# Altium schematic sheet fmc_connections.SchDoc
size 350 x 229 mm; SheetNumber: 8; SheetTotal: 13
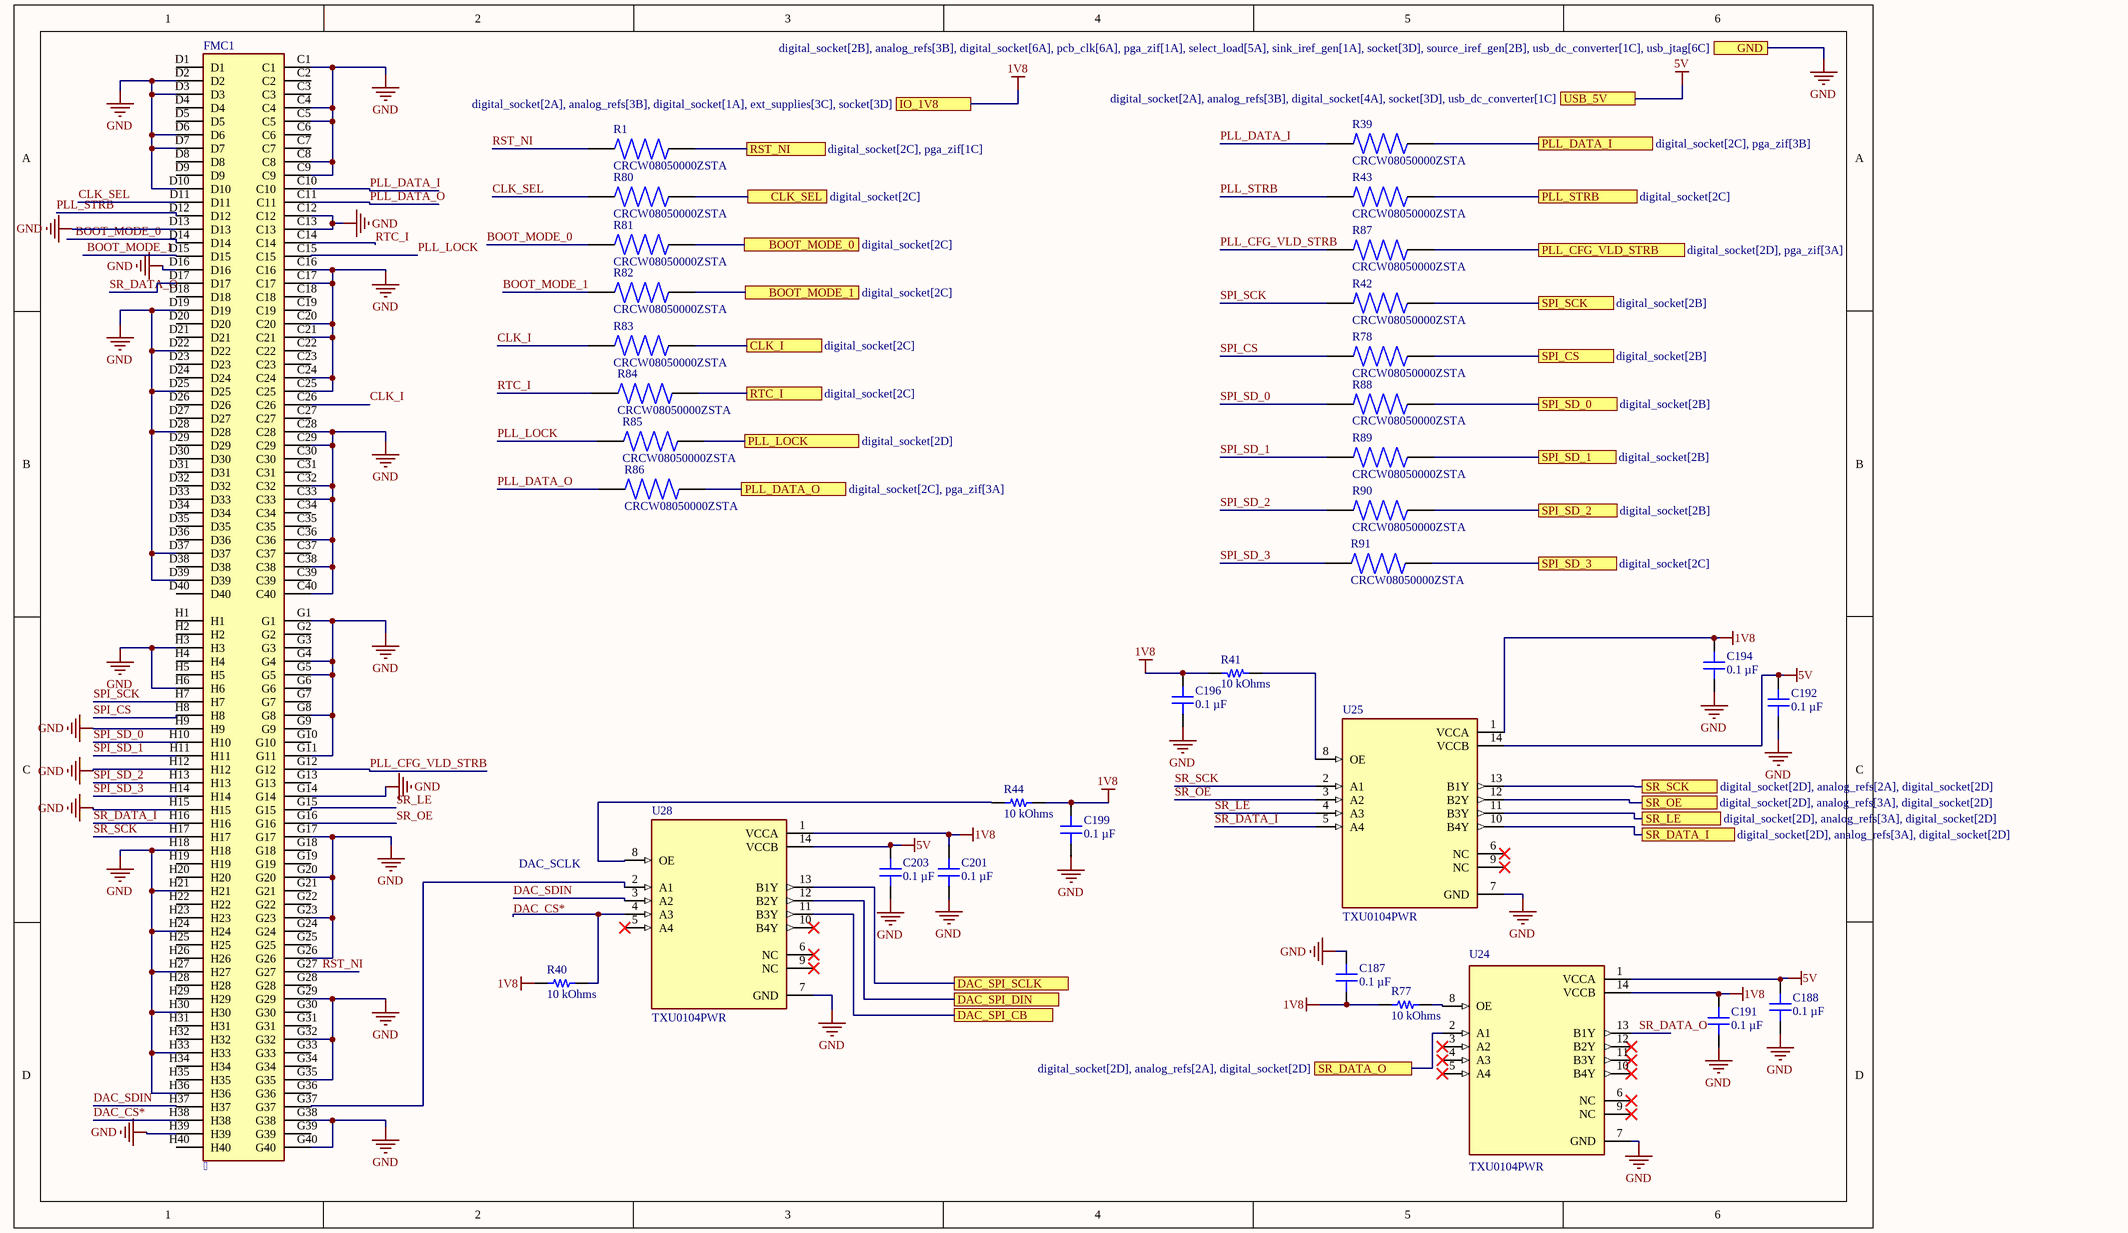
[diagram p0: fmc_connections.SchDoc]

## Parts
C187  0.1 µF  [CAP 0805_2012]
C188  0.1 µF  [CAP 0805_2012]
C191  0.1 µF  [CAP 0805_2012]
C192  0.1 µF  [CAP 0805_2012]
C194  0.1 µF  [CAP 0805_2012]
C196  0.1 µF  [CAP 0805_2012]
C199  0.1 µF  [CAP 0805_2012]
C201  0.1 µF  [CAP 0805_2012]
C203  0.1 µF  [CAP 0805_2012]
FMC1    [SAMTEC_ASP-134604-01]
R1  CRCW08050000ZSTA  [RESC2012X50N]
R39  CRCW08050000ZSTA  [RESC2012X50N]
R40  10 kOhms  [RES 0805_2012]
R41  10 kOhms  [RES 0805_2012]
R42  CRCW08050000ZSTA  [RESC2012X50N]
R43  CRCW08050000ZSTA  [RESC2012X50N]
R44  10 kOhms  [RES 0805_2012]
R77  10 kOhms  [RES 0805_2012]
R78  CRCW08050000ZSTA  [RESC2012X50N]
R80  CRCW08050000ZSTA  [RESC2012X50N]
R81  CRCW08050000ZSTA  [RESC2012X50N]
R82  CRCW08050000ZSTA  [RESC2012X50N]
R83  CRCW08050000ZSTA  [RESC2012X50N]
R84  CRCW08050000ZSTA  [RESC2012X50N]
R85  CRCW08050000ZSTA  [RESC2012X50N]
R86  CRCW08050000ZSTA  [RESC2012X50N]
R87  CRCW08050000ZSTA  [RESC2012X50N]
R88  CRCW08050000ZSTA  [RESC2012X50N]
R89  CRCW08050000ZSTA  [RESC2012X50N]
R90  CRCW08050000ZSTA  [RESC2012X50N]
R91  CRCW08050000ZSTA  [RESC2012X50N]
U24  TXU0104PWR  [SOP65P640X120-14N]
U25  TXU0104PWR  [SOP65P640X120-14N]
U28  TXU0104PWR  [SOP65P640X120-14N]

## Ports
BOOT_MODE_0 (see digital_socket[2C]), BOOT_MODE_1 (see digital_socket[2C]), CLK_I (see digital_socket[2C]), CLK_SEL (see digital_socket[2C]), DAC_SPI_CB (see digital_socket[2B], analog_refs[1B], digital_socket[2B]), DAC_SPI_DIN (see digital_socket[2B], analog_refs[1B], digital_socket[2B]), DAC_SPI_SCLK (see digital_socket[2B], analog_refs[1B], digital_socket[2B]), GND (see digital_socket[2B], analog_refs[3B], digital_socket[6A], pcb_clk[6A], pga_zif[1A], select_load[5A], sink_iref_gen[1A], socket[3D], source_iref_gen[2B], usb_dc_converter[1C], usb_jtag[6C]), IO_1V8 (see digital_socket[2A], analog_refs[3B], digital_socket[1A], ext_supplies[3C], socket[3D]), PLL_CFG_VLD_STRB (see digital_socket[2D], pga_zif[3A]), PLL_DATA_I (see digital_socket[2C], pga_zif[3B]), PLL_DATA_O (see digital_socket[2C], pga_zif[3A]), PLL_LOCK (see digital_socket[2D]), PLL_STRB (see digital_socket[2C]), RST_NI (see digital_socket[2C], pga_zif[1C]), RTC_I (see digital_socket[2C]), SPI_CS (see digital_socket[2B]), SPI_SCK (see digital_socket[2B]), SPI_SD_0 (see digital_socket[2B]), SPI_SD_1 (see digital_socket[2B]), SPI_SD_2 (see digital_socket[2B]), SPI_SD_3 (see digital_socket[2C]), SR_DATA_I (see digital_socket[2D], analog_refs[3A], digital_socket[2D]), SR_DATA_O (see digital_socket[2D], analog_refs[2A], digital_socket[2D]), SR_LE (see digital_socket[2D], analog_refs[3A], digital_socket[2D]), SR_OE (see digital_socket[2D], analog_refs[3A], digital_socket[2D]), SR_SCK (see digital_socket[2D], analog_refs[2A], digital_socket[2D]), USB_5V (see digital_socket[2A], analog_refs[3B], digital_socket[4A], socket[3D], usb_dc_converter[1C])

## Nets
1V8: C187.2 C191.2 C194.2 C196.2 C199.2 C201.2 R40.1 R41.2 R44.2 R77.2 U24.14(VCCB) U25.1(VCCA) U28.1(VCCA) ; port IO_1V8
5V: C188.2 C192.2 C203.2 U24.1(VCCA) U25.14(VCCB) U28.14(VCCB) ; port USB_5V
GND: C187.1 C188.1 C191.1 C192.1 C194.1 C196.1 C199.1 C201.1 C203.1 FMC1.C1 FMC1.C4 FMC1.C5 FMC1.C8 FMC1.C9 FMC1.C12 FMC1.C13 FMC1.C16 FMC1.C17 FMC1.C20 FMC1.C21 FMC1.C24 FMC1.C25 FMC1.C28 FMC1.C29 FMC1.C32 FMC1.C33 FMC1.C36 FMC1.C38 FMC1.C40 FMC1.D2 FMC1.D3 FMC1.D6 FMC1.D7 FMC1.D10 FMC1.D13 FMC1.D16 FMC1.D19 FMC1.D22 FMC1.D25 FMC1.D28 FMC1.D37 FMC1.D39 FMC1.G1 FMC1.G4 FMC1.G5 FMC1.G8 FMC1.G11 FMC1.G14 FMC1.G17 FMC1.G20 FMC1.G23 FMC1.G26 FMC1.G29 FMC1.G32 FMC1.G35 FMC1.G38 FMC1.G40 FMC1.H3 FMC1.H6 FMC1.H9 FMC1.H12 FMC1.H15 FMC1.H18 FMC1.H21 FMC1.H24 FMC1.H27 FMC1.H30 FMC1.H33 FMC1.H36 FMC1.H39 U24.7(GND) U25.7(GND) U28.7(GND) ; port GND
BOOT_MODE_0: FMC1.D14 R81.1
BOOT_MODE_0: R81.2 ; port BOOT_MODE_0  [a separate net that carries the same name]
BOOT_MODE_1: FMC1.D15 R82.1
BOOT_MODE_1: R82.2 ; port BOOT_MODE_1  [a separate net that carries the same name]
CLK_I: FMC1.C26 R83.1
CLK_I: R83.2 ; port CLK_I  [a separate net that carries the same name]
CLK_SEL: FMC1.D11 R80.1
CLK_SEL: R80.2 ; port CLK_SEL  [a separate net that carries the same name]
DAC_CS*: FMC1.H38 R40.2 U28.4(A3)
DAC_SDIN: FMC1.H37 U28.3(A2)
DAC_SPI_CB: U28.11(B3Y) ; port DAC_SPI_CB
DAC_SPI_DIN: U28.12(B2Y) ; port DAC_SPI_DIN
DAC_SPI_SCLK: U28.13(B1Y) ; port DAC_SPI_SCLK
PLL_CFG_VLD_STRB: FMC1.G12 R87.1
PLL_CFG_VLD_STRB: R87.2 ; port PLL_CFG_VLD_STRB  [a separate net that carries the same name]
PLL_DATA_I: FMC1.C10 R39.1
PLL_DATA_I: R39.2 ; port PLL_DATA_I  [a separate net that carries the same name]
PLL_DATA_O: FMC1.C11 R86.1
PLL_DATA_O: R86.2 ; port PLL_DATA_O  [a separate net that carries the same name]
PLL_LOCK: FMC1.C15 R85.1
PLL_LOCK: R85.2 ; port PLL_LOCK  [a separate net that carries the same name]
PLL_STRB: FMC1.D12 R43.1
PLL_STRB: R43.2 ; port PLL_STRB  [a separate net that carries the same name]
RST_NI: FMC1.G27 R1.1
RST_NI: R1.2 ; port RST_NI  [a separate net that carries the same name]
RTC_I: FMC1.C14 R84.1
RTC_I: R84.2 ; port RTC_I  [a separate net that carries the same name]
SPI_CS: FMC1.H8 R78.1
SPI_CS: R78.2 ; port SPI_CS  [a separate net that carries the same name]
SPI_SCK: FMC1.H7 R42.1
SPI_SCK: R42.2 ; port SPI_SCK  [a separate net that carries the same name]
SPI_SD_0: FMC1.H10 R88.1
SPI_SD_0: R88.2 ; port SPI_SD_0  [a separate net that carries the same name]
SPI_SD_1: FMC1.H11 R89.1
SPI_SD_1: R89.2 ; port SPI_SD_1  [a separate net that carries the same name]
SPI_SD_2: FMC1.H13 R90.1
SPI_SD_2: R90.2 ; port SPI_SD_2  [a separate net that carries the same name]
SPI_SD_3: FMC1.H14 R91.1
SPI_SD_3: R91.2 ; port SPI_SD_3  [a separate net that carries the same name]
SR_DATA_I: FMC1.H16 U25.5(A4)
SR_DATA_I: U25.10(B4Y) ; port SR_DATA_I  [a separate net that carries the same name]
SR_DATA_O: FMC1.D17 U24.13(B1Y)
SR_DATA_O: U24.2(A1) ; port SR_DATA_O  [a separate net that carries the same name]
SR_LE: FMC1.G15 U25.4(A3)
SR_LE: U25.11(B3Y) ; port SR_LE  [a separate net that carries the same name]
SR_OE: FMC1.G16 U25.3(A2)
SR_OE: U25.12(B2Y) ; port SR_OE  [a separate net that carries the same name]
SR_SCK: FMC1.H17 U25.2(A1)
SR_SCK: U25.13(B1Y) ; port SR_SCK  [a separate net that carries the same name]
NetFMC1_G37: FMC1.G37 U28.2(A1)
NetR41_1: R41.1 U25.8(OE)
NetR44_1: R44.1 U28.8(OE)
NetR77_1: R77.1 U24.8(OE)

Not connected (* = marked no-connect by the designer): FMC1 C2 C3 C6 C7 C18 C19 C22 C23 C27 C30 C31 C34 C35 C37 C39 D1 D4 D5 D8 D9 D18 D20 D21 D23 D24 D26 D27 D29 D30 D31 D32 D33 D34 D35 D36 D38 D40 G2 G3 G6 G7 G9 G10 G13 G18 G19 G21 G22 G24 G25 G28 G30 G31 G33 G34 G36 G39 H1 H2 H4 H5 H19 H20 H22 H23 H25 H26 H28 H29 H31 H32 H34 H35 H40; U24 3(A2)* 4(A3)* 5(A4)* 6(NC)* 9(NC)* 10(B4Y)* 11(B3Y)* 12(B2Y)*; U25 6(NC)* 9(NC)*; U28 5(A4)* 6(NC)* 9(NC)* 10(B4Y)*

## Notes on the sheet
- DAC_SCLK

## Library data of the parts
C187 C188 C191 C192 C194 C196 C199 C201 C203 = 160R15W104KV4T: CAP CER 0.1UF 16V X7R 0805; manufacturer: Johanson Dielectrics Inc.; Tolerance: ±10%; Part Number: 160R15W104KV4T; Capacitance: 0.1 µF; Applications: General Purpose; componentlink1description: Datasheet; componentlink1url: https://www.johansondielectrics.com/downloads/catalog/johanson-dielectrics-product-catalog.pdf; componentlink2description: DigiKey Link; componentlink2url: https://www.digikey.com/en/products/detail/johanson-dielectrics-inc/160R15W104KV4T/1859428; Device Package: 0805 (2012 Metric); lastupdated: 4/6/2026 7:32:57 PM; Lifecycle Status: Active; Minimum Order: 1; Mounting Type: Surface Mount, MLCC; Operating Temperature: -55°C ~ 125°C; Package / Case: 0805 (2012 Metric); packaging: TapeAndReel; partid: 9125; Part Status: Active; price: 0.03; series: -; Size / Dimension: 0.080" L x 0.050" W (2.03mm x 1.27mm); Supplier 1: DigiKey; Supplier Part Number 1: 709-1183-1-ND; Temperature Coefficient: X7R; Thickness (Max): 0.050" (1.27mm); value: 0.1 µF; Voltage - Rated: 16V
FMC1 = ASP-134604-01: CONN HDR 160POS SMD VITA 57.1; Package: None; MP: ASP-134604-01; Value: *; Availability: Unavailable; Price: None
R1 R39 R42 R43 R78 R80-R91 = CRCW08050000ZSTA: 0 Ohms Jumper 0.125W, 1/8W Chip Resistor 0805 (2012 Metric) Automotive AEC-Q200 Thick Film; MF: Vishay Dale; SnapEDA_Link: https://www.snapeda.com/parts/CRCW08050000ZSTA/Vishay+Dale/view-part/?ref=snap; Package: 2012 Vishay; Value: *; MP: CRCW08050000ZSTA; Check_prices: https://www.snapeda.com/parts/CRCW08050000ZSTA/Vishay+Dale/view-part/?ref=eda
R40 R41 R44 R77 = 3430A2F10KTDF: 3430 A2 1% 10K 100PPM 1K RL; Manufacturer: TE Connectivity Passive Product; Power (Watts): 1W; Temperature Coefficient: ±100ppm/°C; Part Number: 3430A2F10KTDF; Value: 10 kOhms; ComponentLink2Description: DigiKey Link; ComponentLink2URL: https://www.digikey.com/en/products/detail/te-connectivity-passive-product/3430A2F10KTDF/17764190; Composition: Thick Film; Device Package: 0805 (2012 Metric); Features: Automotive AEC-Q200; Height - Seated (Max): 0.026" (0.65mm); LastUpdated: 4/5/2026 8:08:30 PM; Lifecycle Status: Active; Minimum Order: 1; Number of Terminations: 2; Operating Temperature: -55°C ~ 155°C; Package / Case: 0805 (2012 Metric); Packaging: TapeAndReel; PartId: 77781; Part Status: Active; Price: 0.02; Ratings: AEC-Q200; Resistance: 10 kOhms; Series: 3430; Size / Dimension: 0.049" L x 0.079" W (1.25mm x 2.00mm); Supplier 1: DigiKey; Supplier Part Number 1: 1712-3430A2F10KTDFCT-ND; Supplier Device Package: 0508; Tolerance: ±1%
U24 U25 U28 = TXU0104PWR: Four channel unidirectional level shifter; MF: Texas Instruments; SnapEDA_Link: https://www.snapeda.com/parts/TXU0104PWR/Texas+Instruments/view-part/?ref=snap; Package: None; Value: *; MP: TXU0104PWR; Check_prices: https://www.snapeda.com/parts/TXU0104PWR/Texas+Instruments/view-part/?ref=eda